# EAGLE schematic our_motor_driver (EAGLE 8.1.0)
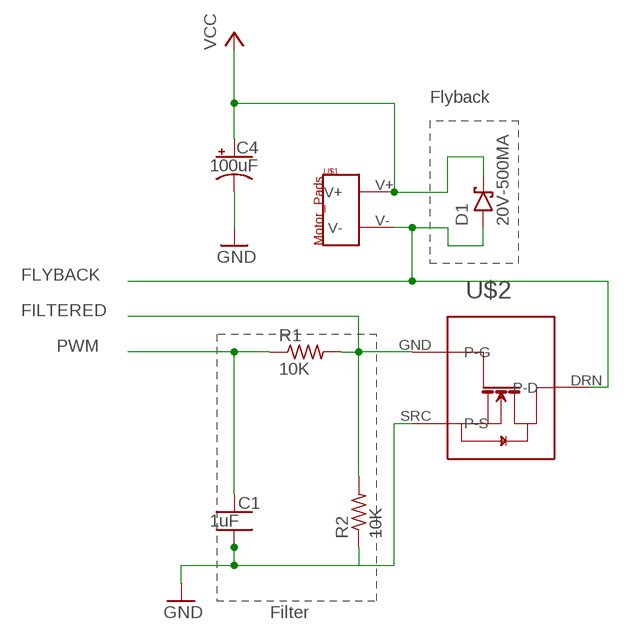
[diagram p0: schematic, sheet 1]

## Parts
C1  1uF  CAPACITOR-NP_SMD-2012-0805_CERAMIC-1UF  [CAPC2012X140_HS]
C4  100uF  CAPACITOR-POL_SMD-7043-D_TANTALUM-220UF  [CAPMP7343X310_HS]
D1  20V-500MA  DIODE-SCHOTTKY_SMD-SOD123  [SOD3716X135_HS]
R1  10K  RESISTOR_SMD-2012-0805-10K  [RESC2012X60_HS]
R2  10K  RESISTOR_SMD-2012-0805-10K  [RESC2012X60_HS]
U$1  MOTOR_PADS  [MOTOR_PADS]
U$2  MOSFET_20V  [MOSFET_20V]

## Nets
FILTERED: R1.2 R2.2 U$2.GND(P-G)
FLYBACK: D1.A U$1.V- U$2.DRN(P-D)
GND: C1.2 C4.2(-) R2.1 U$2.SRC(P-S)
PWM: C1.1 R1.1
VCC: C4.1(+) D1.C U$1.V+

## Notes on the sheet
- Flyback
- Filter

## Library data of the parts
C1 = quadparts_prebuilt:CAPACITOR-NP_: Nonpolarized capacitor; DIST: Digikey; DISTPN: 490-4736-1-ND; MFR: Murata Electronics North America; MPN: GRM21BR71H105KA12L
C4 = quadparts_prebuilt:CAPACITOR-POL_: Polarized capacitor; DIST: Digikey; DISTPN: 478-8912-1-ND; MFR: AVX Corporation; MPN: TAJD227K006RNJ; VALUE: 220uF
D1 = quadparts_prebuilt:DIODE-SCHOTTKY_: Schottky diode
R1 R2 = quadparts_prebuilt:RESISTOR_: Resistor; DIST: Digikey; DISTPN: 311-10KARCT-ND; MFR: Yageo; MPN: RC0805JR-0710KL
U$1 = quadparts_prebuilt:MOTOR_PADS; DIST: NA; DISTPN: NA; MFR: NA; MPN: NA
U$2 = quadparts:MOSFET_20V; CREATOR: Alexander Orr; DIST: Digikey; DISTPN: SI2302CDS-T1-E3CT-ND; MFR: Vishay Siliconix; MPN: SI2302CDS-T1-E3